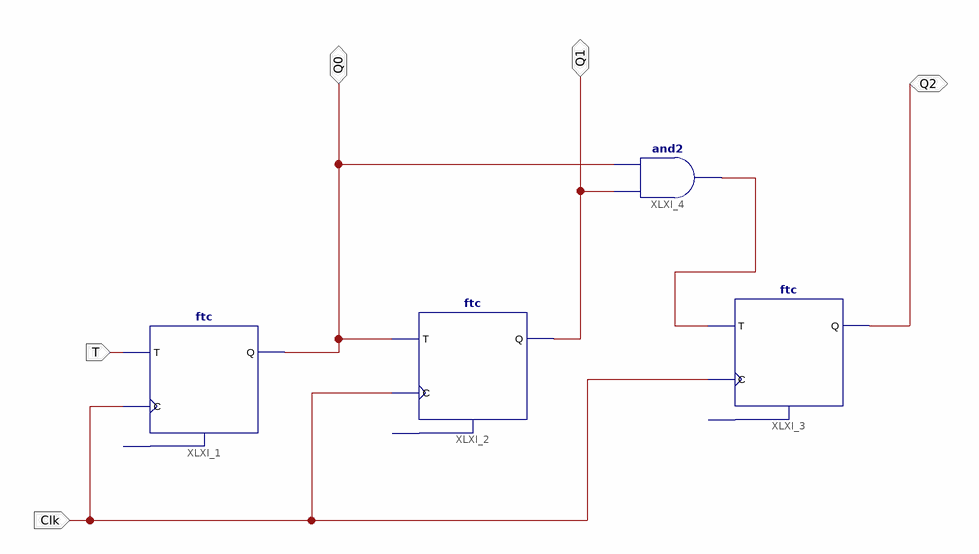
[diagram p0: schematic sheet 1]
// Xilinx ISE schematic mod8counter.sch (spartan3) as structural Verilog: 4 symbols, 5 ports
module mod8counter (
  input  Clk,
  input  T,
  inout  Q0,
  inout  Q1,
  inout  Q2
);

  wire XLXN_3;

  ftc XLXI_1 (.C(Clk), .T(T), .Q(Q0));  // open: CLR
  ftc XLXI_2 (.C(Clk), .T(Q0), .Q(Q1));  // open: CLR
  ftc XLXI_3 (.C(Clk), .T(XLXN_3), .Q(Q2));  // open: CLR
  and XLXI_4 (XLXN_3, Q1, Q0);
endmodule
